# EAGLE design DIDV_-_Alta_Latencia (EAGLE 6.2)
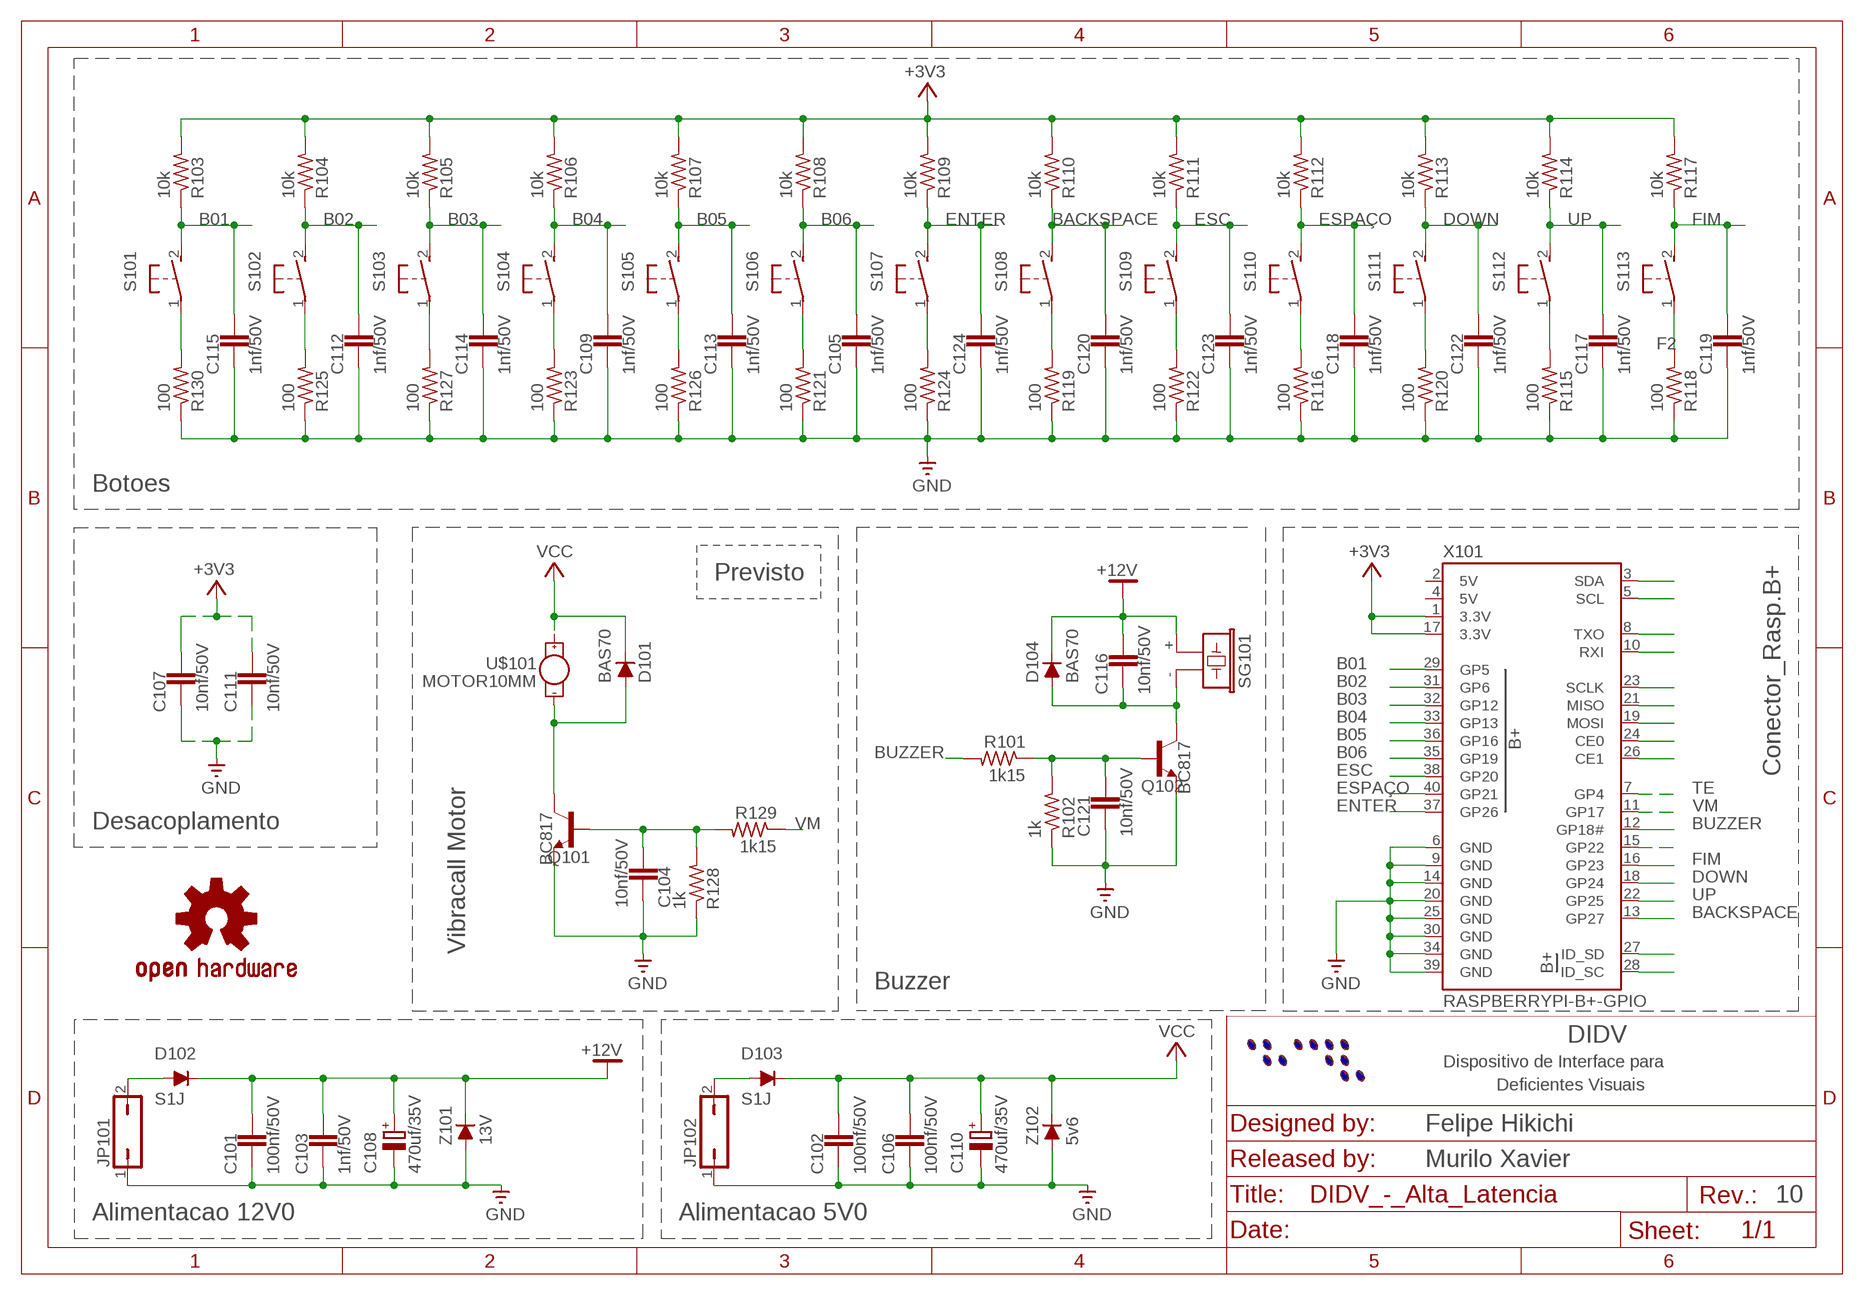
[diagram p0: schematic, sheet 1]

## Parts
C101  100nf/50V  C-EUC0805  [C0805]
C102  100nf/50V  C-EUC0805  [C0805]
C103  1nf/50V  C-EUC0805  [C0805]
C104  10nf/50V  C-EUC0603K  [C0603K]
C105  1nf/50V  C-EUC0603K  [C0603K]
C106  100nf/50V  C-EUC0805  [C0805]
C107  10nf/50V  C-EUC0603K  [C0603K]
C108  470uf/35V  CPOL-EU140CLH-1014  [140CLH-1014]
C109  1nf/50V  C-EUC0603K  [C0603K]
C110  470uf/35V  CPOL-EU140CLH-1014  [140CLH-1014]
C111  10nf/50V  C-EUC0603K  [C0603K]
C112  1nf/50V  C-EUC0603K  [C0603K]
C113  1nf/50V  C-EUC0603K  [C0603K]
C114  1nf/50V  C-EUC0603K  [C0603K]
C115  1nf/50V  C-EUC0603K  [C0603K]
C116  10nf/50V  C-EUC0603K  [C0603K]
C117  1nf/50V  C-EUC0603K  [C0603K]
C118  1nf/50V  C-EUC0603K  [C0603K]
C119  1nf/50V  C-EUC0603K  [C0603K]
C120  1nf/50V  C-EUC0603K  [C0603K]
C121  10nf/50V  C-EUC0603K  [C0603K]
C122  1nf/50V  C-EUC0603K  [C0603K]
C123  1nf/50V  C-EUC0603K  [C0603K]
C124  1nf/50V  C-EUC0603K  [C0603K]
D101  BAS70  BAS40  [SOT23]
D102  S1J  FS1J  [DO214AC]
D103  S1J  FS1J  [DO214AC]
D104  BAS70  BAS40  [SOT23]
JP101  JP1QY  [JP1Y]
JP102  JP1QY  [JP1Y]
LOGO101  OSHW-LOGOL  [OSHW-LOGO-L]
Q101  BC817  BC817-16LT1SMD  [SOT23-BEC]
Q102  BC817  BC817-16LT1SMD  [SOT23-BEC]
R101  1k15  R-US_R0805  [R0805]
R102  1k  R-US_R0805  [R0805]
R103  10k  R-US_R0603  [R0603]
R104  10k  R-US_R0603  [R0603]
R105  10k  R-US_R0603  [R0603]
R106  10k  R-US_R0603  [R0603]
R107  10k  R-US_R0603  [R0603]
R108  10k  R-US_R0603  [R0603]
R109  10k  R-US_R0603  [R0603]
R110  10k  R-US_R0603  [R0603]
R111  10k  R-US_R0603  [R0603]
R112  10k  R-US_R0603  [R0603]
R113  10k  R-US_R0603  [R0603]
R114  10k  R-US_R0603  [R0603]
R115  100  R-US_R0603  [R0603]
R116  100  R-US_R0603  [R0603]
R117  10k  R-US_R0603  [R0603]
R118  100  R-US_R0603  [R0603]
R119  100  R-US_R0603  [R0603]
R120  100  R-US_R0603  [R0603]
R121  100  R-US_R0603  [R0603]
R122  100  R-US_R0603  [R0603]
R123  100  R-US_R0603  [R0603]
R124  100  R-US_R0603  [R0603]
R125  100  R-US_R0603  [R0603]
R126  100  R-US_R0603  [R0603]
R127  100  R-US_R0603  [R0603]
R128  1k  R-US_R0805  [R0805]
R129  1k15  R-US_R0805  [R0805]
R130  100  R-US_R0603  [R0603]
S101  DTS-3  [DTS-3]
S102  DTS-3  [DTS-3]
S103  DTS-3  [DTS-3]
S104  DTS-3  [DTS-3]
S105  DTS-3  [DTS-3]
S106  DTS-3  [DTS-3]
S107  DTS-3  [DTS-3]
S108  DTS-3  [DTS-3]
S109  DTS-3  [DTS-3]
S110  DTS-3  [DTS-3]
S111  DTS-3  [DTS-3]
S112  DTS-3  [DTS-3]
S113  DTS-3  [DTS-3]
SG101  F/CM12P  [F/CM12P]
U$101  MOTOR10MM  [VIBE-MOTOR-10MM]
X101  RASPBERRYPI-B+-GPIO  [2X20-SHROUDED]
Z101  13V  BAS70  [SOT23]
Z102  5v6  BAS70  [SOT23]

## Nets
+3V3: C107.1 C111.1 R103.2 R104.2 R105.2 R106.2 R107.2 R108.2 R109.2 R110.2 R111.2 R112.2 R113.2 R114.2 R117.2 X101.1(3.3V) X101.17(3.3V)
+12V: C101.1 C103.1 C108.+ C116.1 D102.C D104.3(C) SG101.+ Z101.3(C)
B01: C115.1 R103.1 S101.2 X101.29(GP5)
B02: C112.1 R104.1 S102.2 X101.31(GP6)
B03: C114.1 R105.1 S103.2 X101.32(GP12)
B04: C109.1 R106.1 S104.2 X101.33(GP13)
B05: C113.1 R107.1 S105.2 X101.36(GP16)
B06: C105.1 R108.1 S106.2 X101.35(GP19)
BACKSPACE: C120.1 R110.1 S108.2 X101.13(GP27)
BUZZER: R101.2 X101.12(GP18#)
DOWN: C122.1 R113.1 S111.2 X101.18(GP24)
ENTER: C124.1 R109.1 S107.2 X101.37(GP26)
ESC: C123.1 R111.1 S109.2 X101.38(GP20)
ESPAÇO: C118.1 R112.1 S110.2 X101.40(GP21)
F2: R118.2 S113.1
FIM: C119.1 R117.1 S113.2 X101.16(GP23)
GND: C101.2 C102.2 C103.2 C104.2 C105.2 C106.2 C107.2 C108.- C109.2 C110.- C111.2 C112.2 C113.2 C114.2 C115.2 C117.2 C118.2 C119.2 C120.2 C122.2 C123.2 C124.2 JP101.1 JP102.1 Q101.E R115.1 R116.1 R118.1 R119.1 R120.1 R121.1 R122.1 R123.1 R124.1 R125.1 R126.1 R127.1 R128.1 R130.1 X101.6(GND) X101.9(GND) X101.14(GND) X101.20(GND) X101.25(GND) X101.30(GND) X101.34(GND) X101.39(GND) Z101.1(A) Z102.1(A)
N$3: X101.28(ID_SC)
N$4: X101.27(ID_SD)
N$5: X101.26(CE1)
N$6: X101.24(CE0)
N$7: X101.19(MOSI)
N$8: X101.21(MISO)
N$9: X101.23(SCLK)
N$10: X101.10(RXI)
N$11: X101.8(TXO)
N$12: X101.5(SCL)
N$13: X101.3(SDA)
N$14: C116.2 D104.1(A) Q102.C SG101.-
N$15: C121.1 Q102.B R101.1 R102.2
N$16: R130.2 S101.1
N$17: R121.2 S106.1
N$18: R126.2 S105.1
N$19: R123.2 S104.1
N$20: R127.2 S103.1
N$21: R125.2 S102.1
N$22: R124.2 S107.1
N$23: R115.2 S112.1
N$24: R120.2 S111.1
N$25: R116.2 S110.1
N$26: R122.2 S109.1
N$27: R119.2 S108.1
N$28: X101.15(GP22)
N$29: C104.1 Q101.B R128.2 R129.2
N$30: D101.1(A) Q101.C U$101.-
N$31: D102.A JP101.2
N$32: D103.A JP102.2
N$33: C121.2 Q102.E R102.1
TE: X101.7(GP4)
UP: C117.1 R114.1 S112.2 X101.22(GP25)
VCC: C102.1 C106.1 C110.+ D101.3(C) D103.C U$101.+ Z102.3(C)
VM: R129.1 X101.11(GP17)

## Notes on the sheet
- Botoes
- Previsto
- Conector_Rasp.B+
- Desacoplamento
- Vibracall Motor
- Buzzer
- DIDV
- Dispositivo de Interface para
- Deficientes Visuais
- Felipe Hikichi
- Murilo Xavier
- 10
- Alimentacao 12V0 | Alimentacao 5V0

## Power pins joined to a net without a drawn wire
5V: X101.2(5V) X101.4(5V)

## Library data of the parts
C101-C107 C109 C111-C124 = rcl:C-EU: CAPACITOR, European symbol
C108 C110 = rcl:CPOL-EU: POLARIZED CAPACITOR, European symbol
D101 D104 = diode:BAS40: Schottky Barrier Diode 40V General-purpose diode for high-speed switching
D102 D103 = diode:FS1J: Rectifier Diode
JP101 JP102 = jumper:JP1Q: JUMPER
LOGO101 = OpenHW_BOT:OSHW-LOGO: Open Source Hardware Logo This logo indicates the piece of hardware it is found on incorporates a OSHW license and/or adheres to the definition of open source hardware found here: http://freedomdefined.org/OSHW
Q101 Q102 = transistor-npn:BC817*: NPN Transistor
R101-R130 = rcl:R-US_: RESISTOR, American symbol
S101-S113 = switch-tact:DTS-3
SG101 = buzzer:F/CM12P: BUZZER Source: Buerklin
U$101 = SparkFun-Electromechanical:MOTOR: Vibration Motor- ROB-08449 Physical dimension and wire connections for this powerful vibration motor. Motor has a self adhesive backing.
X101 = SparkFun-Boards:RASPBERRYPI-B+-GPIO: Raspberry Pi B+ GPIO Header 2x20 pin connector
Z101 Z102 = diode:BAS70: Silicon Schottky Diodes General-purpose diode for high-speed switching

## Board
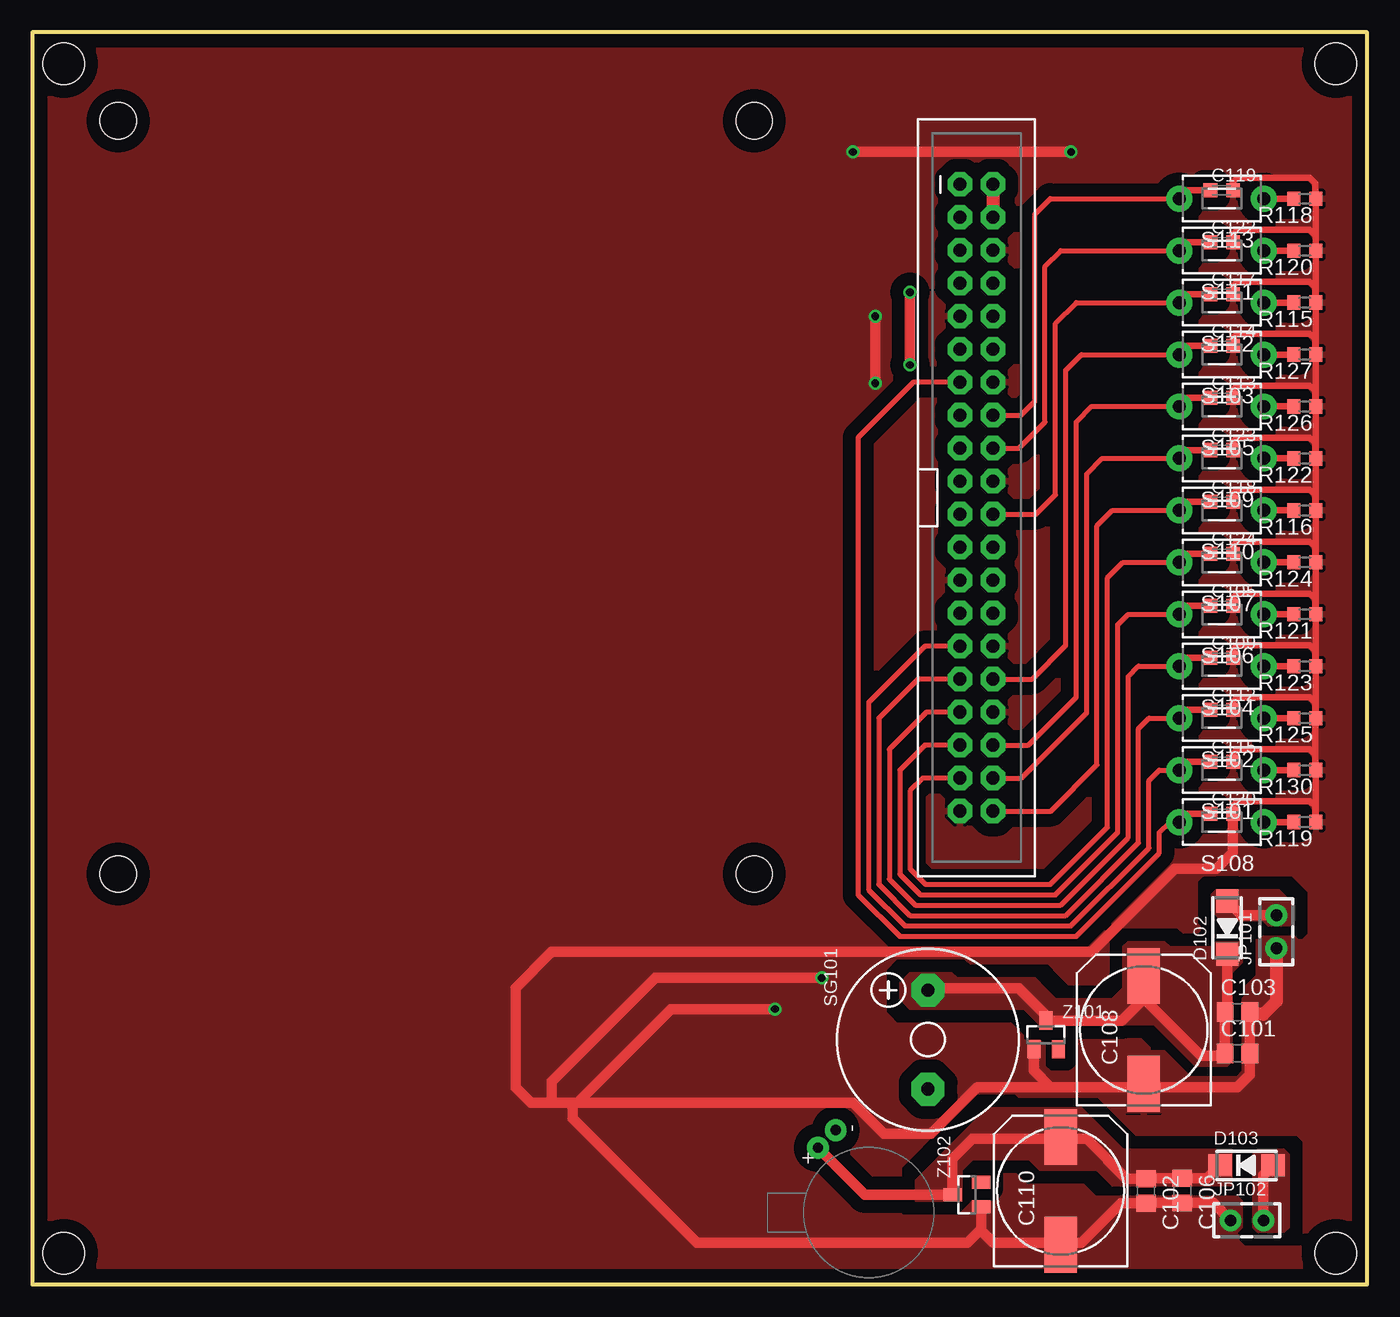
[diagram p1: board, top side]
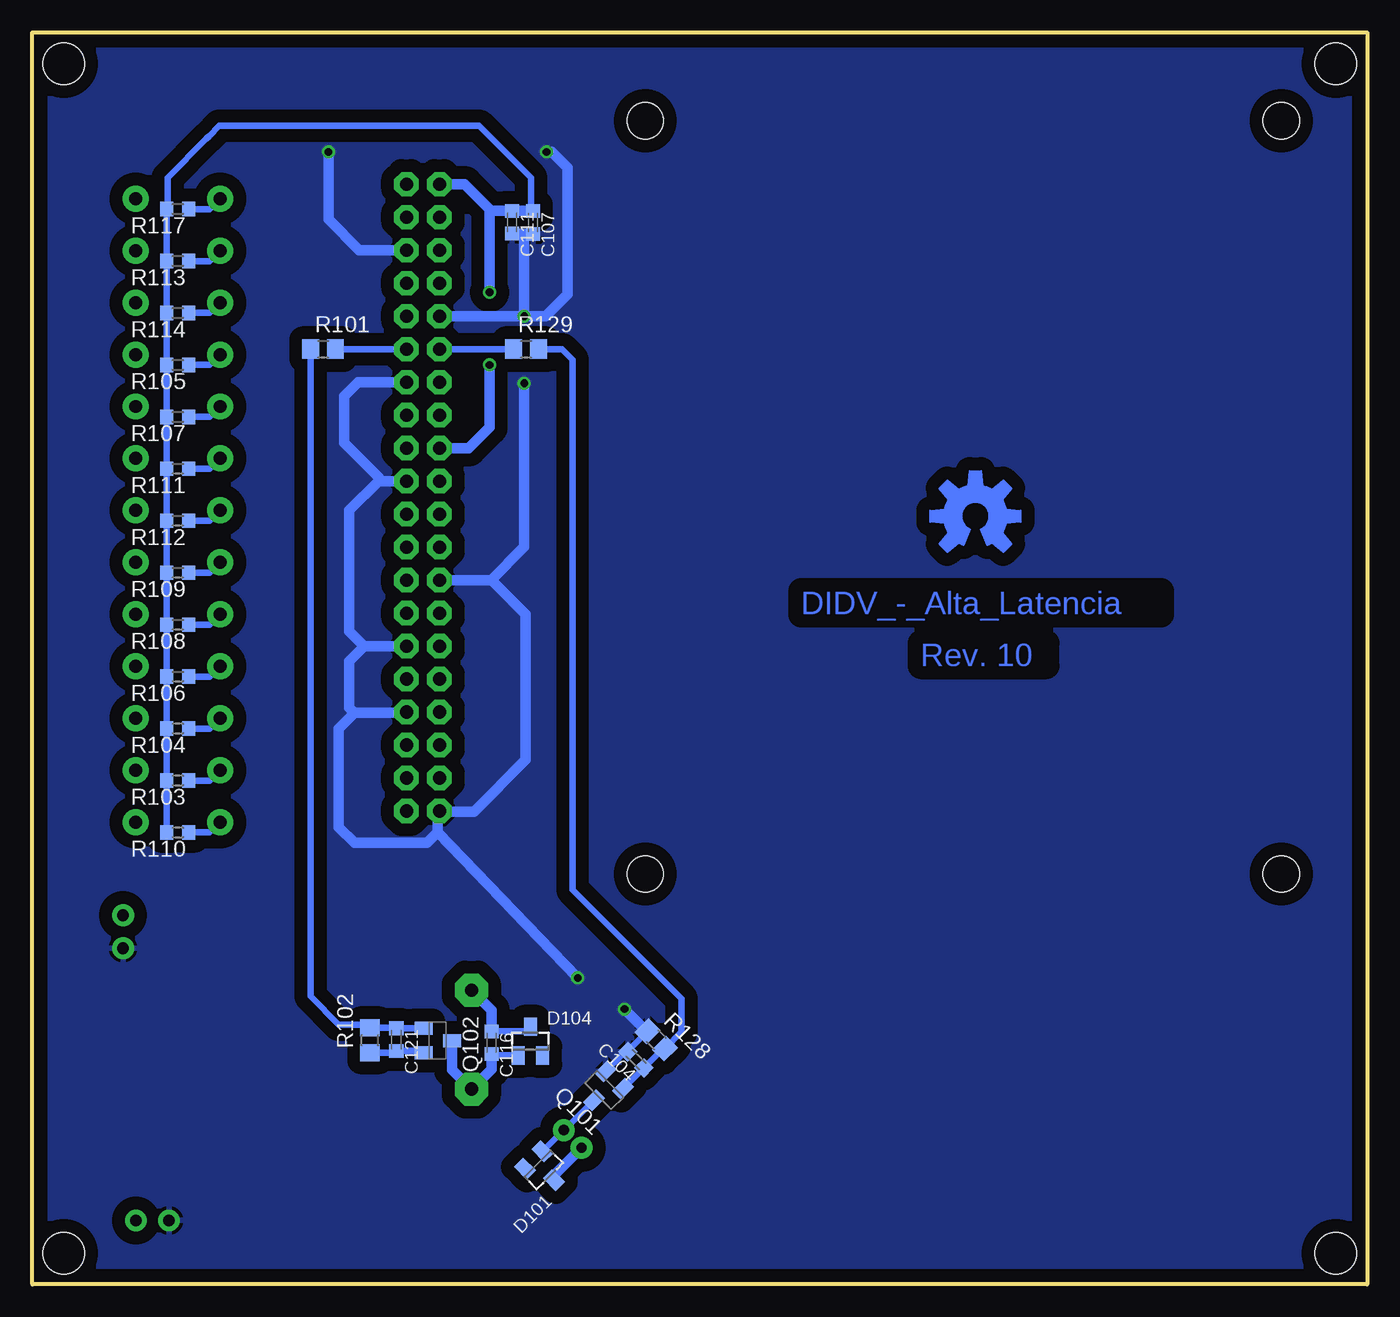
[diagram p2: board, bottom side, seen from below]

Size 102.8 x 96.4 mm. Coordinates in mm from the lower left corner, seen from the top.
Outline: 0,0 102.8,0 102.8,96.4 0,96.4 0,0
Copper layers (1*16): Top 0.035mm / dielectric 1.5mm / Bottom 0.035mm
Design rules: minimum track width 10mil, minimum drill 24mil, track to track 8mil, track to pad 8mil, pad to pad 8mil, via to via 8mil, smd to smd 8mil, copper to edge 40mil, drill to drill 8mil, minimum pad ring 10mil, minimum via ring 8mil, stop-mask expansion 4mil, vias tented up to drill 0mil, thermal gap 10mil
Holes 2.8 mm at 55.6,31.6 55.6,89.6 6.6,89.6 6.6,31.6
Holes 3.2 mm at 2.4,94 100.4,94 100.4,2.4 2.4,2.4

### Footprints (pad centres in the part's own frame; a part is rotated, then mirrored left to right if it is on the bottom)
C0805 = smd 1.3 x 1.5: 1 -0.95,0; 2 0.95,0
C0603K = smd 1.05 x 1.08: 1 -0.875,0; 2 0.875,0
140CLH-1014 = smd 4.3 x 2.5: + 4.15,0; - -4.15,0
SOT23 = smd 1 x 1.4: 1 -0.95,-1.1; 2 0.95,-1.1; 3 0,1.1
DO214AC = smd 1.8 x 1.7: A 2.05,0; C -2.05,0
JP1Y = drill 0.9 pad 1.676: 1 0,-1.27; 2 0,1.27
SOT23-BEC = smd 1 x 1.4: B -0.95,-1.1; C 0,1.1; E 0.95,-1.1
R0805 = smd 1.3 x 1.5: 1 -0.95,0; 2 0.95,0
R0603 = smd 1 x 1.1: 1 -0.85,0; 2 0.85,0
DTS-3 = drill 1 pad 2: 1 -3.25,0; 2 3.25,0
F/CM12P = drill 1.016 pad 2.54 octagon: + 3.81,0; - -3.81,0
VIBE-MOTOR-10MM = drill 0.8 pad 1.676: + -5,-3.9; - -6.35,-2.54
2X20-SHROUDED = drill 1.016 pad 1.88 octagon: 1 -1.27,24.13; 2 1.27,24.13; 3 -1.27,21.59; 4 1.27,21.59; 5 -1.27,19.05; 6 1.27,19.05; 7 -1.27,16.51; 8 1.27,16.51; 9 -1.27,13.97; 10 1.27,13.97; 11 -1.27,11.43; 12 1.27,11.43; 13 -1.27,8.89; 14 1.27,8.89; 15 -1.27,6.35; 16 1.27,6.35; 17 -1.27,3.81; 18 1.27,3.81; 19 -1.27,1.27; 20 1.27,1.27; 21 -1.27,-1.27; 22 1.27,-1.27; 23 -1.27,-3.81; 24 1.27,-3.81; 25 -1.27,-6.35; 26 1.27,-6.35; 27 -1.27,-8.89; 28 1.27,-8.89; 29 -1.27,-11.43; 30 1.27,-11.43; 31 -1.27,-13.97; 32 1.27,-13.97; 33 -1.27,-16.51; 34 1.27,-16.51; 35 -1.27,-19.05; 36 1.27,-19.05; 37 -1.27,-21.59; 38 1.27,-21.59; 39 -1.27,-24.13; 40 1.27,-24.13

### Placement (x,y rotation side)
C101  92.81,17.79 0 top
C102  85.77,7.19 270 top
C103  92.81,20.97 0 top
C104  56.31,17.3 135 bottom
C105  91.6,52.26 0 top
C106  88.57,7.22 270 top
C107  64.25,81.77 270 bottom
C108  85.6,19.6 90 top
C109  91.6,48.26 0 top
C110  79.19,7.2 90 top
C111  65.85,81.79 270 bottom
C112  91.6,44.25 0 top
C113  91.6,68.26 0 top
C114  91.6,72.26 0 top
C115  91.6,40.26 0 top
C116  67.45,18.61 270 bottom
C117  91.6,76.26 0 top
C118  91.6,60.25 0 top
C119  91.6,84.26 0 top
C120  91.6,36.25 0 top
C121  74.77,18.85 270 bottom
C122  91.6,80.26 0 top
C123  91.6,64.25 0 top
C124  91.6,56.26 0 top
D101  63.41,8.81 225 bottom
D102  92.03,27.47 90 top
D103  93.52,9.17 0 top
D104  64.45,18.73 0 bottom
JP101  95.82,27.15 0 top
JP102  93.55,4.93 270 top
LOGO101  30.17,59.15 0 top
Q101  58.76,14.96 135 bottom
Q102  71.58,18.78 270 bottom
R101  80.42,72.01 0 bottom
R102  76.8,18.8 90 bottom
R103  91.6,38.8 180 bottom
R104  91.6,42.8 180 bottom
R105  91.6,70.8 180 bottom
R106  91.6,46.8 180 bottom
R107  91.6,66.8 180 bottom
R108  91.6,50.8 180 bottom
R109  91.6,54.8 180 bottom
R110  91.6,34.8 180 bottom
R111  91.6,62.8 180 bottom
R112  91.6,58.8 180 bottom
R113  91.6,78.8 180 bottom
R114  91.6,74.8 180 bottom
R115  98,75.6 180 top
R116  98,59.6 180 top
R117  91.6,82.8 180 bottom
R118  98,83.6 180 top
R119  98,35.6 180 top
R120  98,79.6 180 top
R121  98,51.6 180 top
R122  98,63.6 180 top
R123  98,47.6 180 top
R124  98,55.6 180 top
R125  98,43.6 180 top
R126  98,67.6 180 top
R127  98,71.6 180 top
R128  54.75,18.83 315 bottom
R129  64.78,72.01 0 bottom
R130  98,39.6 180 top
S101  91.6,39.6 180 top
S102  91.6,43.6 180 top
S103  91.6,71.6 180 top
S104  91.6,47.6 180 top
S105  91.6,67.6 180 top
S106  91.6,51.6 180 top
S107  91.6,55.6 180 top
S108  91.6,35.6 180 top
S109  91.6,63.6 180 top
S110  91.6,59.6 180 top
S111  91.6,79.6 180 top
S112  91.6,75.6 180 top
S113  91.6,83.6 180 top
SG101  68.98,18.85 90 top
U$101  64.41,5.53 270 top
X101  72.72,60.58 0 top
Z101  78.07,19.22 0 top
Z102  71.98,6.92 90 top

### Tracks (layer width: path | path; a pad name or v marks a point on that pad's centre or on a via)
5V
  Top 1: X101.2 X101.4
+3V3  (via drill 0.6)
  Top 0.8: v67.6,76.4 v67.6,70.8
  Bottom 0.5: R110.2 R103.2 R104.2 R106.2 R108.2 R109.2 R112.2 R111.2 R107.2 R105.2 R114.2 R113.2 R117.2 92.4,82.85 92.4,85.2 89.4,88.2 89.2,88.4 88.4,89.2 68.4,89.2 64.4,85.2 64.4,82.8 C107.1
  Bottom 0.8: X101.1 69.51,84.71 67.6,82.8 | 67.6,82.8 v67.6,76.4 | v67.6,70.8 67.6,66 69.2,64.4 X101.17 | 67.6,82.8 67.47,82.67 C111.1 64.27,82.67 C107.1
+12V
  Top 0.406: 69.12,22.8 SG101.+
  Top 0.8: D102.C 92.03,21.14 C103.1 C101.1 91.67,17.6 90,17.6 85.6,22 | C108.+ 85.6,22 | 85.6,22 83.92,20.32 Z101.3 78.07,20.73 76,22.8 69.12,22.8
  Bottom 0.5: C116.1 64.8,19.48 D104.3
  Bottom 0.8: C116.1 67.45,21.13 SG101.+
  pour Top (no thermals): 93.2,26.4 91.2,26.4 90.8,26 87.6,26 87.2,26.4 84.4,26.4 84,26 84,22.8 83.2,22 78.8,22 78,22.8 77.2,23.6 71.2,23.6 70.8,24 67.6,24 66.8,23.2 66.8,22 67.2,21.6 67.6,21.2 76.4,21.2 76.8,20.8 77.6,20 86.4,20 86.8,19.6 88.4,18 89.6,16.8 92,16.8 92.4,17.2 92.4,24 93.2,24.8
B01
  Top 0.4: X101.29 68.75,49.15 64.4,44.8 64.4,30.4 67.2,27.6 80,27.6 86,33.6 86,38.8 86.8,39.6 S101.2
  Top 0.5: C115.1 89.01,40.26 S101.2
  Bottom 0.5: R103.1 89.15,38.8 S101.2
B02
  Top 0.4: X101.31 68.21,46.61 65.2,43.6 65.2,30.8 67.6,28.4 79.6,28.4 85.2,34 85.2,42.8 86,43.6 S102.2 87.6,43.6
  Top 0.5: C112.1 89,44.25 S102.2
  Bottom 0.5: R104.1 89.15,42.8 S102.2
B03
  Top 0.4: X101.32 77.01,46.61 79.6,49.2 79.6,70.4 80.8,71.6 S103.2
  Top 0.5: C114.1 89.01,72.26 S103.2
  Bottom 0.5: R105.1 89.15,70.8 S103.2
B04
  Top 0.4: X101.33 68.87,44.07 66,41.2 66,31.2 68,29.2 79.2,29.2 84.4,34.4 84.4,46.8 85.2,47.6 S104.2
  Top 0.5: C109.1 89.01,48.26 S104.2
  Bottom 0.5: R106.1 89.15,46.8 S104.2
B05
  Top 0.4: X101.36 76.73,41.53 80.4,45.2 80.4,66.4 81.6,67.6 S105.2
  Top 0.5: C113.1 89.01,68.26 S105.2
  Bottom 0.5: R107.1 89.15,66.8 S105.2
B06
  Top 0.4: X101.35 68.73,41.53 66.8,39.6 66.8,31.6 68.4,30 78.8,30 83.6,34.8 83.6,50.8 84.4,51.6 S106.2
  Top 0.5: C105.1 89.01,52.26 S106.2
  Bottom 0.5: R108.1 89.15,50.8 S106.2
BACKSPACE
  Top 0.4: X101.13 67.87,69.47 63.6,65.2 63.6,30 66.8,26.8 80.4,26.8 86.8,33.2 86.8,34.8 87.6,35.6 S108.2
  Top 0.5: C120.1 89,36.25 S108.2
  Bottom 0.5: R110.1 89.15,34.8 S108.2
BUZZER
  Bottom 0.4: R101.2 79.59,72.01 79.6,72
  Bottom 0.5: 79.6,72 X101.12
DOWN
  Top 0.4: X101.18 75.99,64.39 78,66.4 78,78.4 79.2,79.6 S111.2
  Top 0.5: C122.1 89.01,80.26 S111.2
  Bottom 0.5: R113.1 89.15,78.8 S111.2
ENTER
  Top 0.4: X101.37 68.59,38.99 67.6,38 67.6,32 68.8,30.8 78.4,30.8 82.8,35.2 82.8,54.4 84,55.6 S107.2
  Top 0.5: C124.1 89.01,56.26 S107.2
  Bottom 0.5: R109.1 89.15,54.8 S107.2
ESC
  Top 0.4: X101.38 76.19,38.99 81.2,44 81.2,62.4 82.4,63.6 S109.2
  Top 0.5: C123.1 89,64.25 S109.2
  Bottom 0.5: R111.1 89.15,62.8 S109.2
ESPAÇO
  Top 0.4: X101.40 78.45,36.45 82,40 82,58.4 83.2,59.6 S110.2
  Top 0.5: C118.1 89,60.25 S110.2
  Bottom 0.5: R112.1 89.15,58.8 S110.2
F2
  Top 0.5: R118.2 S113.1
FIM
  Top 0.4: X101.16 76.13,66.93 77.2,68 77.2,82.4 78.4,83.6 S113.2
  Top 0.5: C119.1 89.01,84.26 S113.2
  Bottom 0.5: R117.1 89.15,82.8 S113.2
GND  (via drill 0.6)
  Top 0.5: C120.2 92.47,36.88 92.8,37.2 98.4,37.2 98.8,36.8 98.8,35.65 R119.1 R130.1 98.8,39.65 98.8,40.8 | C115.2 92.47,40.88 92.8,41.2 98.4,41.2 98.8,40.8 | C112.2 92.47,44.88 92.8,45.2 98.4,45.2 98.8,44.8 98.8,43.65 R125.1 | C109.2 92.47,48.88 92.8,49.2 98.4,49.2 98.8,48.8 98.8,47.65 R123.1 | C105.2 92.47,52.88 92.8,53.2 98.4,53.2 98.8,52.8 98.8,51.65 R121.1 | C124.2 92.47,56.88 92.8,57.2 98.4,57.2 98.8,56.8 98.8,55.65 R124.1 | C118.2 92.47,60.88 92.8,61.2 98.4,61.2 98.8,60.8 98.8,59.65 R116.1 | C123.2 92.47,64.88 92.8,65.2 98.4,65.2 98.8,64.8 98.8,63.65 R122.1 | C113.2 92.47,68.88 92.8,69.2 98.4,69.2 98.8,68.8 98.8,67.65 R126.1 | C114.2 92.47,72.88 92.8,73.2 98.4,73.2 98.8,72.8 98.8,71.65 R127.1 | C117.2 92.47,76.88 92.8,77.2 98.4,77.2 98.8,76.8 98.8,75.65 R115.1 | C122.2 92.47,80.88 92.8,81.2 98.4,81.2 98.85,80.75 R120.1 | R120.1 R118.1 98.8,83.65 98.8,84.8 98.4,85.2 92.8,85.2 92.47,84.88 C119.2 | R120.1 R115.1 | R115.1 R127.1 | R127.1 R126.1 | R126.1 R122.1 | R122.1 R116.1 | R116.1 R124.1 | R124.1 R121.1 | R121.1 R123.1 | R123.1 R125.1 | R125.1 98.85,43.25 98.8,43.2 98.8,40.8
  Top 0.8: C103.2 C101.2 93.76,16.16 92.8,15.2 85.85,15.2 | 85.85,15.2 C108.- | Z101.1 77.12,16.48 78.4,15.2 | 78.4,15.2 85.85,15.2 | JP102.1 90.94,6.27 C106.2 85.8,6.27 C102.2 83.84,6.24 80.8,3.2 79.34,3.2 C110.- 79.04,3.2 74,3.2 73.08,4.12 Z102.1 73.08,4.28 72,3.2 51.2,3.2 41.6,12.8 41.6,14 | v64.92,74.55 v64.92,69.4 | 78.4,15.2 72.8,15.2 69.2,11.6 65.6,11.6 63.2,14 42,14 | v57.2,21.2 49.2,21.2 42,14 | 42,14 41.6,14 | 41.6,14 40,14 | 40,14 38.4,14 37.2,15.2 37.2,22.8 40,25.6 81.6,25.6 88,32 91.2,32 92.47,33.27 C120.2 | v60.8,23.6 48,23.6 40,15.6 40,14 | v63.2,87.2 v80,87.2
  Top 1: JP101.1 95.82,21.82 94.8,20.8 93.93,20.8 C103.2
  Bottom 0.5: 55.42,19.42 R128.1 56.93,17.99 C104.2 57.15,17.91 Q101.E
  Bottom 0.8: 71.6,74.4 X101.9 v64.92,74.55 | v64.92,69.4 64.92,56.81 67.49,54.24 X101.25 67.43,54.23 64.8,51.6 64.8,40.4 68.8,36.4 71.4,36.4 X101.39 71.6,36.3 71.6,34.8 | 74.06,44 78,44 | 78,44 79.2,42.8 79.2,35.2 78,34 72.4,34 71.6,34.8 | X101.30 77.25,49.15 | 77.25,49.15 78.4,48 78.4,44.4 78,44 | X101.20 76.15,61.85 | 76.15,61.85 78.4,59.6 78.4,50.3 77.25,49.15 | X101.14 77.73,69.47 78.8,68.4 78.8,64.8 76.15,62.15 76.15,61.85 | R128.1 55.5,19.5 v57.2,21.2 | v60.8,23.6 71.6,34.8 | C111.2 64.8,80.92 | 64.8,80.92 64.27,80.92 C107.2 | v64.92,74.55 64.92,80.8 64.8,80.92 | X101.6 77.63,79.63 80,82 v80,87.2 | v63.2,87.2 62.8,87.2 61.6,86 61.6,76.23 63.28,74.55 v64.92,74.55
  pour Top: 98,37.6 98.4,38 98.8,38 98.8,37.2 98,37.2
  pour Top: 98,37.6 98.4,38 98.8,38 98.8,37.2 98,37.2
  pour Top: 98,41.6 98.4,42 98.8,42 98.8,41.2 98,41.2
  pour Top: 98,45.6 98.4,46 98.8,46 98.8,45.2 98,45.2
  pour Top: 98,49.6 98.4,50 98.8,50 98.8,49.2 98,49.2
  pour Top: 98,53.6 98.4,54 98.8,54 98.8,53.2 98,53.2
  pour Top: 98,57.6 98.4,58 98.8,58 98.8,57.2 98,57.2
  pour Top: 98,61.6 98.4,62 98.8,62 98.8,61.2 98,61.2
  pour Top: 98,65.6 98.4,66 98.8,66 98.8,65.2 98,65.2
  pour Top: 98,69.6 98.4,70 98.8,70 98.8,69.2 98,69.2
  pour Top: 98,73.6 98.4,74 98.8,74 98.8,73.2 98,73.2
  pour Top: 98,77.6 98.4,78 98.8,78 98.8,77.2 98,77.2
  pour Top: 98,81.6 98.4,82 98.8,82 98.8,81.2 98,81.2
  pour Top (isolate 1, rank 6): 0,96.4 102.8,96.4 102.8,0 0,0
  pour Bottom (isolate 1, rank 6): 0,96.4 102.8,96.4 102.8,0 0,0
  pour Top (no thermals): 96,26.8 97.2,26.8 97.6,26.4 97.6,24.8 97.2,24.4 97.2,16 95.6,14.4 88.8,14.4 87.6,13.2 83.6,13.2 82.8,14 82.4,14.4 76,14.4 75.6,14.8 75.6,18 76.4,18.8 77.6,18.8 78,18.4 78,16.8 78.4,16.4 82.4,16.4 84,18 87.2,18 88,17.2 89.2,16 92.8,16 93.2,16.4 93.2,22 93.6,22.4 94.4,23.2 94.4,26.4 94.8,26.8
  pour Top (no thermals): 92.8,4 93.2,4.4 93.2,6.4 92.8,6.8 81.6,6.8 80.8,6 74.8,6 74.4,6.4 72.4,6.4 70,4 70,2.4 70.8,1.6 76.8,1.6 77.6,0.8 92.4,0.8 92.8,1.2
N$14
  Bottom 0.5: D104.1 67.34,17.63 C116.2
  Bottom 0.8: C116.2 67.45,16.57 SG101.- 70.48,16.54 Q102.C
N$15
  Bottom 0.5: R101.1 81.37,22.17 79.2,20 77.05,20 R102.2 74.8,19.75 C121.1 Q102.B
N$16
  Top 0.5: R130.2 S101.1
N$17
  Top 0.5: R121.2 S106.1
N$18
  Top 0.5: R126.2 S105.1
N$19
  Top 0.5: R123.2 S104.1
N$20
  Top 0.5: R127.2 S103.1
N$21
  Top 0.5: R125.2 S102.1
N$22
  Top 0.5: S107.1 R124.2
N$23
  Top 0.5: R115.2 S112.1
N$24
  Top 0.5: R120.2 S111.1
N$25
  Top 0.5: R116.2 S110.1
N$26
  Top 0.5: R122.2 S109.1
N$27
  Top 0.5: R119.2 S108.1
N$29
  Bottom 0.5: Q101.B C104.1 54.22,18.16 R128.2 52.8,19.44 52.8,22 61.2,30.4 61.2,71.2 62.01,72.01 R129.2
N$30
  Bottom 0.5: D101.1 61.9,11.88 U$101.- 59.56,14.18 Q101.C
N$31
  Top 0.8: JP101.2 93.13,28.42 D102.A
  pour Top (no thermals): 94.8,28 95.2,27.6 96.8,27.6 97.2,28 97.2,29.2 96.8,29.6 96.4,30 96,30.4 91.2,30.4 90.8,30 90.8,28.8 91.6,28
N$32
  Top 0.8: JP102.2 94.82,8.42 D103.A
  pour Top (no thermals): 94.4,4 94,4.4 94,10 94.4,10.4 96.4,10.4 96.8,10 96.8,4.4 96.4,4
N$33
  Bottom 0.5: R102.1 74.89,17.85 C121.2 72.83,17.98 Q102.E
UP
  Top 0.4: X101.22 77.31,59.31 78.8,60.8 78.8,74 80.4,75.6 S112.2
  Top 0.5: C117.1 89.01,76.26 S112.2
  Bottom 0.5: R114.1 89.15,74.8 S112.2
VCC
  Top 0.8: D103.C 90.47,8.17 C106.1 85.8,8.17 C102.1 84.26,8.14 81.2,11.2 79.34,11.2 C110.+ 79.04,11.2 72.4,11.2 70.88,9.68 Z102.3 64.11,6.92 U$101.+
  Bottom 0.8: D101.3 62.64,8.4 U$101.+
  pour Top (no thermals): 92.4,10.4 84,10.4 80.8,13.6 73.6,13.6 71.2,11.2 68,8 68,6.4 71.6,6.4 71.6,8.8 72.4,9.6 76.8,9.6 77.6,8.8 82,8.8 83.2,7.6 92.4,7.6
VM
  Bottom 0.5: R129.1 X101.11
(copper drawn outside any net)
  shapes: Bottom circle x4

### Text on the board
Bottom: DIDV_-_Alta_Latencia | Rev. 10